# Altium schematic sheet Sheet4_Switch.SchDoc
size A4
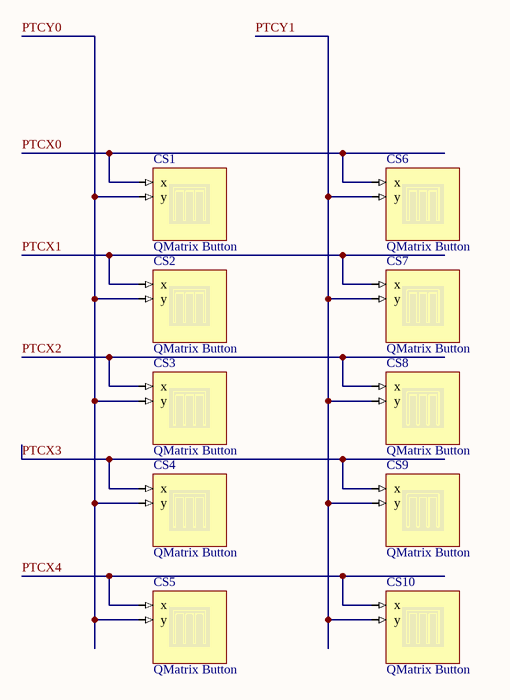
[diagram p0: Sheet4_Switch.SchDoc]

## Parts
CS1  QMatrix Button  [qtouchsw]  (no BOM)
CS2  QMatrix Button  [qtouchsw]  (no BOM)
CS3  QMatrix Button  [qtouchsw]  (no BOM)
CS4  QMatrix Button  [qtouchsw]  (no BOM)
CS5  QMatrix Button  [qtouchsw]  (no BOM)
CS6  QMatrix Button  [qtouchsw]  (no BOM)
CS7  QMatrix Button  [qtouchsw]  (no BOM)
CS8  QMatrix Button  [qtouchsw]  (no BOM)
CS9  QMatrix Button  [qtouchsw]  (no BOM)
CS10  QMatrix Button  [qtouchsw]  (no BOM)

## Nets
PTCX0: CS1.x CS6.x
PTCX1: CS2.x CS7.x
PTCX2: CS3.x CS8.x
PTCX3: CS4.x CS9.x
PTCX4: CS5.x CS10.x
PTCY0: CS1.y CS2.y CS3.y CS4.y CS5.y
PTCY1: CS6.y CS7.y CS8.y CS9.y CS10.y

## Library data of the parts
CS1-CS10 = QMatrixButton: ConfiguratorName: ATMEL_TOUCH; ConfigurationParameters: {}__sensorid[2]{}width[7]{}height[7]{}t[1]{}ywidth[0.3]{}